# Altium schematic sheet Voltage10.SchDoc
size A4
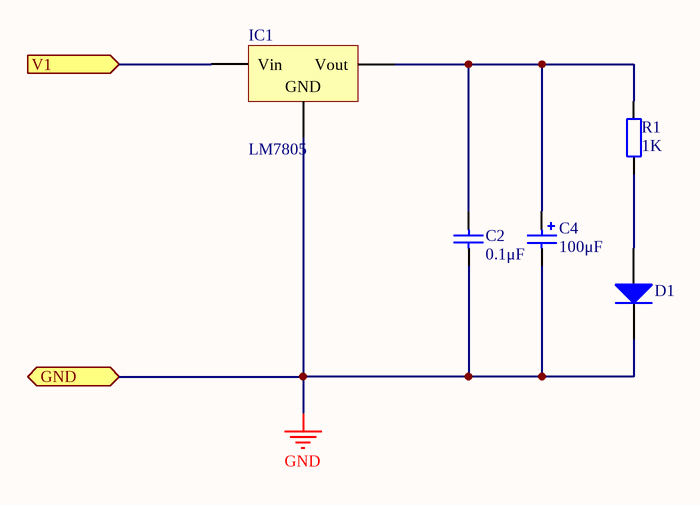
[diagram p0: Voltage10.SchDoc]

## Parts
C2  value 0.1μF  [RAD-0.3]  (hidden comment: Cap)
C4  value 100μF  [POLAR0.8]  (hidden comment: Cap Pol2)
D1  Diode  [DSO-C2/X3.3]  (value not drawn)
IC1  LM7805  [TO254P1510-3_4L]
R1  value 1K  [AXIAL-0.4]  (hidden comment: Res2)

## Ports
GND (bidir), V1 (in)

## Nets
GND: C2.1 C4.2 D1.2(K) IC1.2(GND) ; port GND
V1: IC1.1(Vin) ; port V1
NetC2_2: C2.2 C4.1 IC1.3(Vout) R1.2
NetD1_1: D1.1(A) R1.1

## Library data of the parts
C2 = Cap: Capacitor; Published: 8-Jun-2000; LatestRevisionDate: 17-Jul-2002; LatestRevisionNote: Re-released for DXP Platform.; PackageReference: RAD-0.3; Publisher: Altium Limited
C4 = Cap Pol2: Polarized Capacitor (Axial); Published: 8-Jun-2000; LatestRevisionDate: 17-Jul-2002; LatestRevisionNote: Re-released for DXP Platform.; PackageReference: POLAR0.8; Publisher: Altium Limited
D1 = Diode: Default Diode; Published: 8-Jun-2000; LatestRevisionDate: 17-Jul-2002; LatestRevisionNote: Re-released for DXP Platform.; PackageVersion: Sep-1996; PackageReference: SMC; Publisher: Altium Limited; Code_JEDEC: DO-214-AB
IC1 = Volt Reg: Voltage Regulator; Published: 24-Mar-1999; LatestRevisionDate: 29-May-2009; LatestRevisionNote: IPC-7351 Footprint Added.; PackageReference: D2PAK; Publisher: Altium Limited; PackageDescription: 3-Pin Transistor Outline Package 2.54 mm Pitch, 15.1 mm Lead Span
R1 = Res2: Resistor; Published: 8-Jun-2000; LatestRevisionDate: 17-Jul-2002; LatestRevisionNote: Re-released for DXP Platform.; PackageReference: AXIAL-0.4; Publisher: Altium Limited